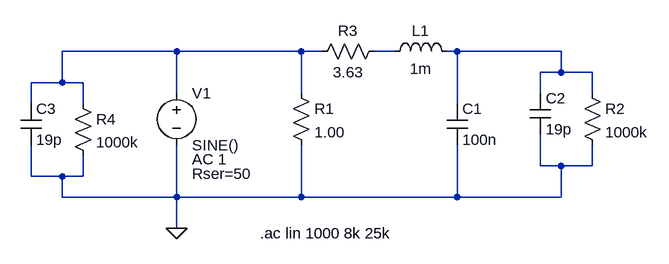
[diagram p0: schematic LCR Analysis.asc]
LCR Analysis.asc, the LTspice schematic file:
Version 4
SHEET 1 880 680
WIRE 32 192 -144 192
WIRE 224 192 32 192
WIRE 256 192 224 192
WIRE 368 192 336 192
WIRE 464 192 448 192
WIRE 624 192 464 192
WIRE 624 224 624 192
WIRE 624 224 592 224
WIRE 672 224 624 224
WIRE -144 240 -144 192
WIRE -144 240 -192 240
WIRE -112 240 -144 240
WIRE 32 256 32 192
WIRE 224 256 224 192
WIRE 592 256 592 224
WIRE 672 256 672 224
WIRE -192 272 -192 240
WIRE -112 272 -112 240
WIRE 464 272 464 192
WIRE 592 368 592 320
WIRE 624 368 592 368
WIRE 672 368 672 336
WIRE 672 368 624 368
WIRE -192 384 -192 336
WIRE -144 384 -192 384
WIRE -112 384 -112 352
WIRE -112 384 -144 384
WIRE -144 416 -144 384
WIRE 32 416 32 336
WIRE 32 416 -144 416
WIRE 224 416 224 336
WIRE 224 416 32 416
WIRE 464 416 464 336
WIRE 464 416 224 416
WIRE 624 416 624 368
WIRE 624 416 464 416
WIRE 32 464 32 416
FLAG 32 464 0
SYMBOL ind 352 208 R270
WINDOW 0 32 56 VTop 2
WINDOW 3 5 56 VBottom 2
SYMATTR InstName L1
SYMATTR Value 1m
SYMBOL cap 448 272 R0
SYMATTR InstName C1
SYMATTR Value 100n
SYMBOL res 208 240 R0
SYMATTR InstName R1
SYMATTR Value 1.00
SYMBOL voltage 32 240 R0
WINDOW 123 24 118 Left 2
WINDOW 39 24 140 Left 2
SYMATTR Value2 AC 1
SYMATTR SpiceLine Rser=50
SYMATTR InstName V1
SYMATTR Value SINE()
SYMBOL cap 576 256 R0
SYMATTR InstName C2
SYMATTR Value 19p
SYMBOL res 656 240 R0
SYMATTR InstName R2
SYMATTR Value 1000k
SYMBOL res 352 176 R90
WINDOW 0 0 56 VBottom 2
WINDOW 3 32 56 VTop 2
SYMATTR InstName R3
SYMATTR Value 3.63
SYMBOL cap -208 272 R0
SYMATTR InstName C3
SYMATTR Value 19p
SYMBOL res -128 256 R0
SYMATTR InstName R4
SYMATTR Value 1000k
TEXT 160 472 Left 2 !.ac lin 1000 8k 25k

The netlist it stands for:
* LCR Analysis.asc
L1 N002 N003 1m
C1 N003 0 100n
R1 N001 0 1.00
V1 N001 0 SINE() AC 1 Rser=50
C2 N003 0 19p
R2 N003 0 1000k
R3 N002 N001 3.63
C3 N001 0 19p
R4 N001 0 1000k
.ac lin 1000 8k 25k
.backanno
.end